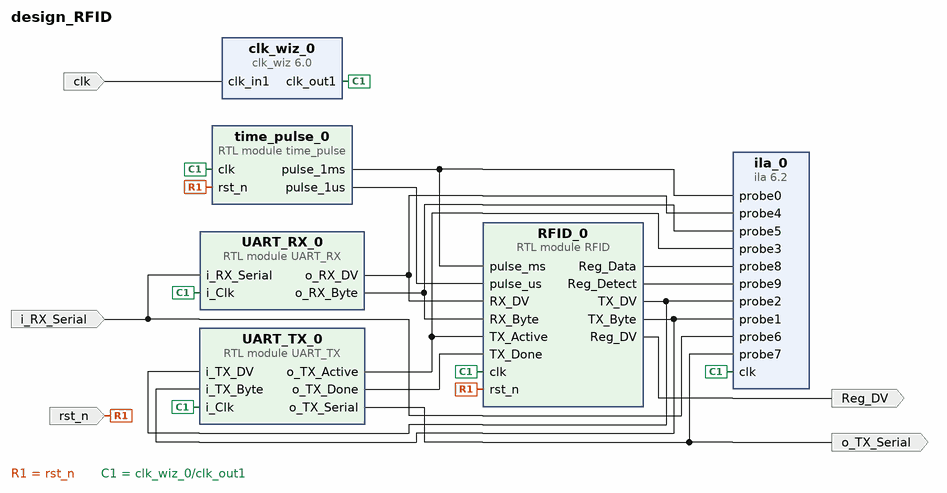
[diagram p0: block diagram of the top level]
# Vivado block design design_RFID, xc7z020clg400-1, Vivado 2020.2
create_bd_design design_RFID

create_bd_port -dir O o_TX_Serial
create_bd_port -dir I i_RX_Serial
create_bd_port -dir O Reg_DV
create_bd_port -dir I -type clk clk
create_bd_port -dir I -type rst rst_n

create_bd_cell -type module -reference time_pulse time_pulse_0
set_property -dict {CONFIG.freq_clk_MHz 50} [get_bd_cells time_pulse_0]
create_bd_cell -type ip -vlnv xilinx.com:ip:ila:6.2 ila_0
set_property -dict [list \
  CONFIG.C_DATA_DEPTH 65536 \
  CONFIG.C_ENABLE_ILA_AXI_MON false \
  CONFIG.C_MONITOR_TYPE Native \
  CONFIG.C_NUM_OF_PROBES 11 \
  CONFIG.C_PROBE10_WIDTH 4 \
  CONFIG.C_PROBE11_WIDTH 1 \
  CONFIG.C_PROBE12_WIDTH 1 \
  CONFIG.C_PROBE1_WIDTH 8 \
  CONFIG.C_PROBE5_WIDTH 8 \
  CONFIG.C_PROBE8_WIDTH 16 \
] [get_bd_cells ila_0]
create_bd_cell -type ip -vlnv xilinx.com:ip:clk_wiz:6.0 clk_wiz_0
set_property -dict [list \
  CONFIG.CLKIN1_JITTER_PS 100.0 \
  CONFIG.CLKOUT1_DRIVES BUFG \
  CONFIG.CLKOUT1_JITTER 203.457 \
  CONFIG.CLKOUT1_PHASE_ERROR 155.540 \
  CONFIG.CLKOUT1_REQUESTED_OUT_FREQ 50 \
  CONFIG.CLKOUT2_DRIVES BUFG \
  CONFIG.CLKOUT3_DRIVES BUFG \
  CONFIG.CLKOUT4_DRIVES BUFG \
  CONFIG.CLKOUT5_DRIVES BUFG \
  CONFIG.CLKOUT6_DRIVES BUFG \
  CONFIG.CLKOUT7_DRIVES BUFG \
  CONFIG.FEEDBACK_SOURCE FDBK_AUTO \
  CONFIG.MMCM_BANDWIDTH OPTIMIZED \
  CONFIG.MMCM_CLKFBOUT_MULT_F 17 \
  CONFIG.MMCM_CLKIN1_PERIOD 10.000 \
  CONFIG.MMCM_CLKIN2_PERIOD 10.000 \
  CONFIG.MMCM_CLKOUT0_DIVIDE_F 17 \
  CONFIG.MMCM_COMPENSATION ZHOLD \
  CONFIG.MMCM_DIVCLK_DIVIDE 2 \
  CONFIG.PLL_CLKIN_PERIOD 10.000 \
  CONFIG.PRIMITIVE PLL \
  CONFIG.USE_LOCKED false \
  CONFIG.USE_RESET false \
] [get_bd_cells clk_wiz_0]
create_bd_cell -type module -reference UART_RX UART_RX_0
create_bd_cell -type module -reference UART_TX UART_TX_0
create_bd_cell -type module -reference RFID RFID_0

# ---- connections ----

connect_bd_net [get_bd_pins RFID_0/TX_DV] [get_bd_pins ila_0/probe2] [get_bd_pins UART_TX_0/i_TX_DV]
connect_bd_net [get_bd_pins RFID_0/TX_Byte] [get_bd_pins ila_0/probe1] [get_bd_pins UART_TX_0/i_TX_Byte]
connect_bd_net [get_bd_pins UART_RX_0/o_RX_DV] [get_bd_pins ila_0/probe4] [get_bd_pins RFID_0/RX_DV]
connect_bd_net [get_bd_pins UART_RX_0/o_RX_Byte] [get_bd_pins ila_0/probe5] [get_bd_pins RFID_0/RX_Byte]
connect_bd_net [get_bd_pins UART_TX_0/o_TX_Active] [get_bd_pins ila_0/probe3] [get_bd_pins RFID_0/TX_Active]
connect_bd_net [get_bd_pins UART_TX_0/o_TX_Done] [get_bd_pins RFID_0/TX_Done]
connect_bd_net [get_bd_pins UART_TX_0/o_TX_Serial] [get_bd_ports o_TX_Serial] [get_bd_pins ila_0/probe7]
connect_bd_net -net i_RX_Serial_0_1 [get_bd_ports i_RX_Serial] [get_bd_pins ila_0/probe6] [get_bd_pins UART_RX_0/i_RX_Serial]
connect_bd_net [get_bd_pins RFID_0/Reg_DV] [get_bd_ports Reg_DV]
connect_bd_net [get_bd_pins time_pulse_0/pulse_1ms] [get_bd_pins ila_0/probe0] [get_bd_pins RFID_0/pulse_ms]
connect_bd_net -net rst_n_0_1 [get_bd_ports rst_n] [get_bd_pins time_pulse_0/rst_n] [get_bd_pins RFID_0/rst_n]
connect_bd_net [get_bd_pins RFID_0/Reg_Data] [get_bd_pins ila_0/probe8]
connect_bd_net [get_bd_pins RFID_0/Reg_Detect] [get_bd_pins ila_0/probe9]
connect_bd_net [get_bd_pins time_pulse_0/pulse_1us] [get_bd_pins RFID_0/pulse_us]
connect_bd_net [get_bd_ports clk] [get_bd_pins clk_wiz_0/clk_in1]
connect_bd_net [get_bd_pins clk_wiz_0/clk_out1] \
  [get_bd_pins time_pulse_0/clk] [get_bd_pins ila_0/clk] [get_bd_pins UART_RX_0/i_Clk] [get_bd_pins UART_TX_0/i_Clk] \
  [get_bd_pins RFID_0/clk]

validate_bd_design
save_bd_design
